# Altium schematic sheet Supplies01.SchDoc
size A4; SheetNumber: 2; SheetTotal: 2
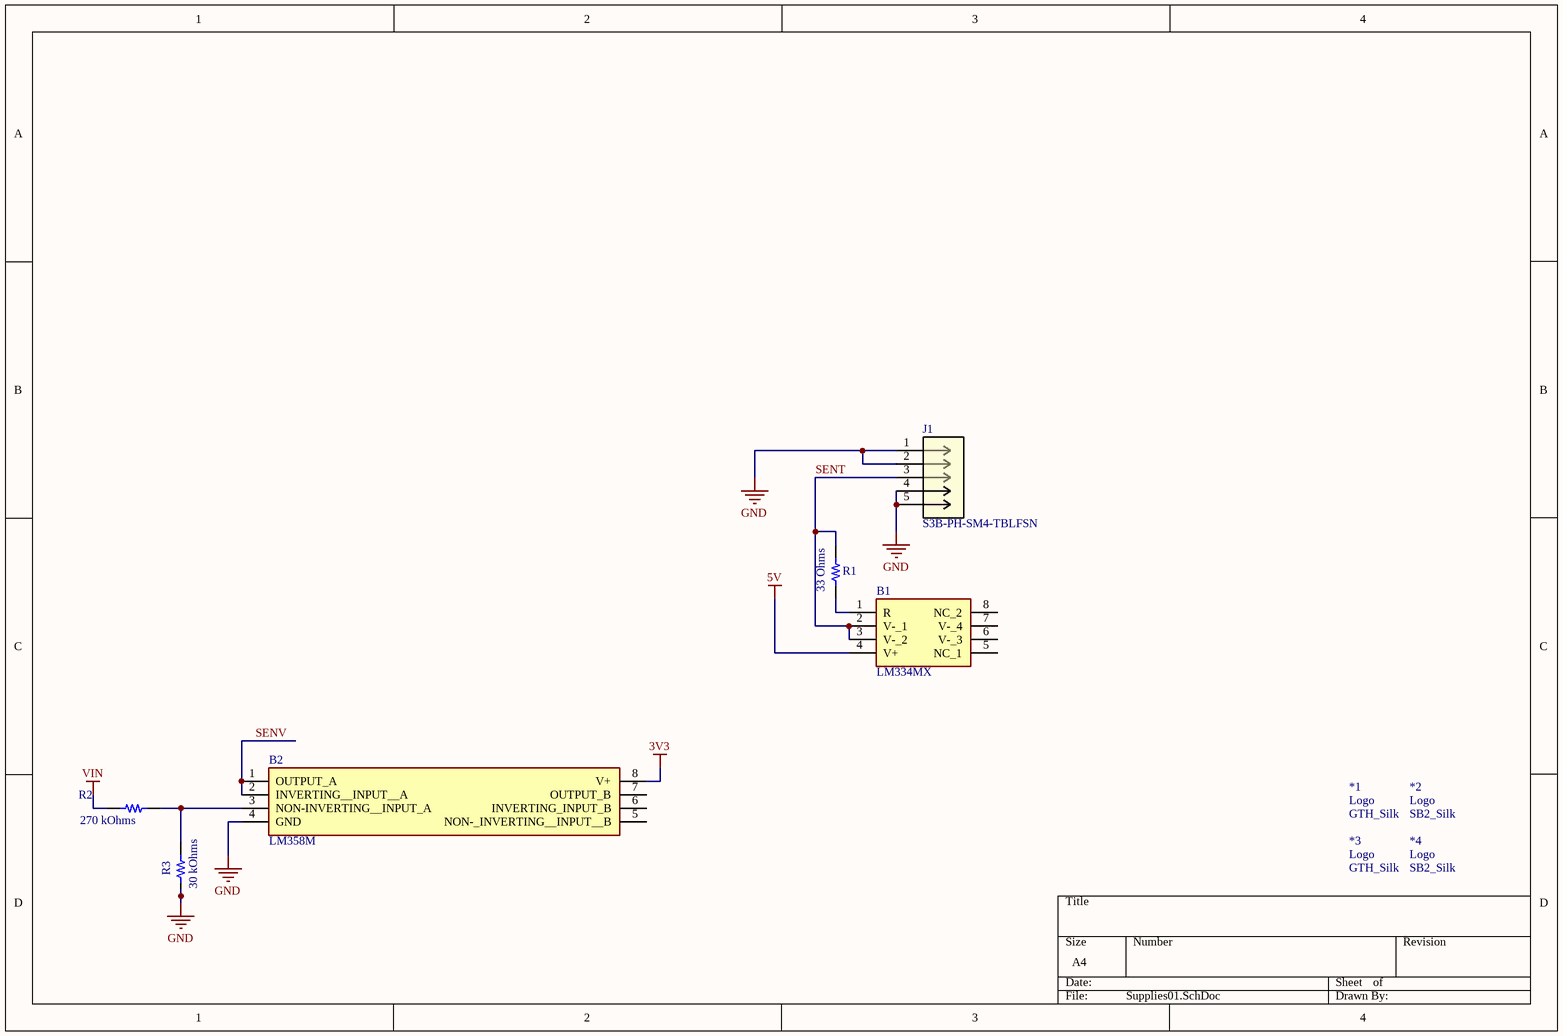
[diagram p0: Supplies01.SchDoc]

## Parts
*1  GTH_Silk  [TECHHUB_SILK]
*2  SB2_Silk  [SMARTBEDDING2_SILK]
*3  GTH_Silk  [TECHHUB_SILK]
*4  SB2_Silk  [SMARTBEDDING2_SILK]
B1  LM334MX  [SOIC127P600X175-8N]
B2  LM358M  [SOIC127P600X175-8N]
J1  S3B-PH-SM4-TBLFSN  [CONN_S3B-PH-SM4-TBLFSN_JST]
R1  33 Ohms  [YAGEO RES 0603_1608]
R2  270 kOhms  [YAGEO RES 0603_1608]
R3  30 kOhms  [YAGEO RES 0603_1608]

## Nets
3V3: B2.8(V+)
5V: B1.4(V+)
GND: B2.4(GND) J1.1 J1.2 J1.4 J1.5 R3.1
VIN: R2.2
SENT: B1.2(V-_1) B1.3(V-_2) J1.3 R1.1
SENV: B2.1(OUTPUT_A) B2.2(INVERTING__INPUT__A)
NetB1_1: B1.1(R) R1.2
NetB2_3: B2.3(NON-INVERTING__INPUT_A) R2.1 R3.2

Not connected (* = marked no-connect by the designer): B1 5(NC_1) 6(V-_3) 7(V-_4) 8(NC_2); B2 5(NON-_INVERTING__INPUT__B) 6(INVERTING_INPUT_B) 7(OUTPUT_B)

## Notes on the sheet
- (in symbol GTH_Silk) Logo
- (in symbol SB2_Silk) Logo

## Library data of the parts
B1 = LM334MX: Current & Power Monitors & Regulators 3-Terminal Adjustable Current Source 8-SOIC 0 to 70; Manufacturer_Name: Texas Instruments; Geometry.Height: 1.75mm; Manufacturer_Part_Number: LM334MX; Mouser Part Number: 926-LM334MX; Mouser Price/Stock: https://www.mouser.co.uk/ProductDetail/Texas-Instruments/LM334MX?qs=X1J7HmVL2ZFtDDpPn2fvWQ%3D%3D; Arrow Part Number: *; Arrow Price/Stock: *; Datasheet Link: https://www.ti.com/lit/ds/symlink/lm334.pdf?ts=1637153972899&ref_url=https%253A%252F%252Fwww.ti.com%252Fstore%252Fti%252Fen%252Fp%252Fproduct%252F%253Fp%253DLM334MX%252FNOPB
B2 = LM358M: Low Power Dual Operational Amplifiers; Manufacturer_Name: Texas Instruments; Geometry.Height: 1.75mm; Manufacturer_Part_Number: LM358M; Mouser Part Number: 926-LM358M; Mouser Price/Stock: https://www.mouser.co.uk/ProductDetail/Texas-Instruments/LM358M?qs=QbsRYf82W3HovI3qmwfgKw%3D%3D; Arrow Part Number: LM358M; Arrow Price/Stock: https://www.arrow.com/en/products/lm358m/texas-instruments?region=nac; Datasheet Link: http://www.ti.com/general/docs/suppproductinfo.tsp?distId=10&gotoUrl=http%3A%2F%2Fwww.ti.com%2Flit%2Fgpn%2Flm158-n
J1 = S3B-PH-SM4-TBLFSN: No Description Available; Mfr_Name: JST; RefDes: RefDes; Type: Type
R1 = RC0603JR-0733RL: RES 33 OHM 5% 1/10W 0603; Manufacturer: Yageo; Power (Watts): 0.1W, 1/10W; Temperature Coefficient: ±100ppm/°C; Tolerance: ±5%; Value: 33 Ohms; Part Number: RC0603JR-0733RL; ComponentLink1Description: Datasheet; ComponentLink1URL: https://www.yageo.com/upload/media/product/productsearch/datasheet/rchip/PYu-RC_Group_51_RoHS_L_10.pdf; ComponentLink2Description: DigiKey Link; ComponentLink2URL: https://www.digikey.com/en/products/detail/yageo/RC0603JR-0733RL/726771; Composition: Thick Film; Device Package: 0603 (1608 Metric); Features: Moisture Resistant; Height - Seated (Max): 0.022" (0.55mm); LastUpdated: 2024-07-25 09:19:24; Lifecycle Status: Active; Minimum Order: 1; Number of Terminations: 2; Operating Temperature: -55°C ~ 155°C; Package / Case: 0603 (1608 Metric); Packaging: CutTape; PartId: 17082; Part Status: Active; Price: 0.01; Resistance: 33 Ohms; Series: RC_L; Size / Dimension: 0.063" L x 0.031" W (1.60mm x 0.80mm); Supplier 1: DigiKey; Supplier Part Number 1: 311-33GRCT-ND; Supplier Device Package: 0603
R2 = RC0603FR-07270KL: RES 270K OHM 1% 1/10W 0603; Manufacturer: Yageo; Power (Watts): 0.1W, 1/10W; Temperature Coefficient: ±100ppm/°C; Tolerance: ±1%; Value: 270 kOhms; Part Number: RC0603FR-07270KL; ComponentLink1Description: Datasheet; ComponentLink1URL: https://www.yageo.com/upload/media/product/productsearch/datasheet/rchip/PYu-RC_Group_51_RoHS_L_10.pdf; ComponentLink2Description: DigiKey Link; ComponentLink2URL: https://www.digikey.com/en/products/detail/yageo/RC0603FR-07270KL/727104; Composition: Thick Film; Device Package: 0603 (1608 Metric); Features: Moisture Resistant; Height - Seated (Max): 0.022" (0.55mm); LastUpdated: 2024-07-25 09:19:27; Lifecycle Status: Active; Minimum Order: 1; Number of Terminations: 2; Operating Temperature: -55°C ~ 155°C; Package / Case: 0603 (1608 Metric); Packaging: CutTape; PartId: 12358; Part Status: Active; Price: 0.01; Resistance: 270 kOhms; Series: RC_L; Size / Dimension: 0.063" L x 0.031" W (1.60mm x 0.80mm); Supplier 1: DigiKey; Supplier Part Number 1: 311-270KHRCT-ND; Supplier Device Package: 0603
R3 = AC0603FR-0730KL: RES SMD 30K OHM 1% 1/10W 0603; Manufacturer: Yageo; Power (Watts): 0.1W, 1/10W; Temperature Coefficient: ±100ppm/°C; Tolerance: ±1%; Value: 30 kOhms; Part Number: AC0603FR-0730KL; ComponentLink1Description: Datasheet; ComponentLink1URL: https://www.yageo.com/upload/media/product/productsearch/datasheet/rchip/PYu-AC_51_RoHS_L_7.pdf; ComponentLink2Description: DigiKey Link; ComponentLink2URL: https://www.digikey.com/en/products/detail/yageo/AC0603FR-0730KL/5896025; Composition: Thick Film; Device Package: 0603 (1608 Metric); Features: Automotive AEC-Q200, Moisture Resistant; Height - Seated (Max): 0.022" (0.55mm); LastUpdated: 2024-07-25 09:19:23; Lifecycle Status: Active; Minimum Order: 1; Number of Terminations: 2; Operating Temperature: -55°C ~ 155°C; Package / Case: 0603 (1608 Metric); Packaging: CutTape; PartId: 17451; Part Status: Active; Price: 0.01; Ratings: AEC-Q200; Resistance: 30 kOhms; Series: AC; Size / Dimension: 0.063" L x 0.031" W (1.60mm x 0.80mm); Supplier 1: DigiKey; Supplier Part Number 1: YAG3593CT-ND; Supplier Device Package: 0603